# Altium schematic sheet USB Input.SchDoc
size A4; SheetNumber: 4; SheetTotal: 13
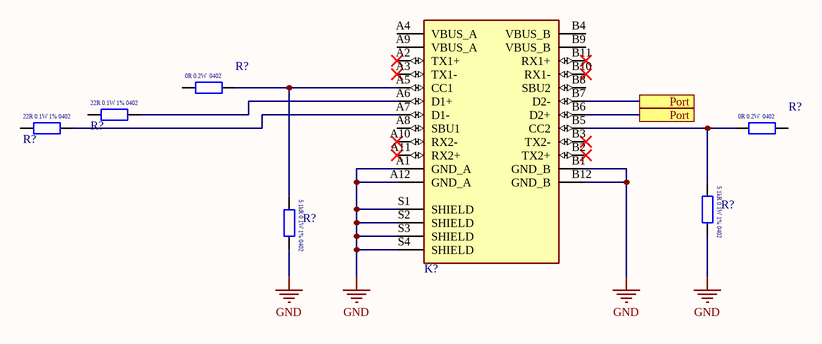
[diagram p0: USB Input.SchDoc]

## Parts
(Parts that share a designator on the sheet are numbered #1, #2 ... from top to bottom, then left to right.)
K?  2171830001  [217183-0001]  (value not drawn)
R?#1  CRCW04020000Z0EDHP  [RESC1005X04L]  (value not drawn)
R?#2  RK73H1ETTP22R0F  [RESC1005X04N]  (value not drawn)
R?#3  RK73H1ETTP22R0F  [RESC1005X04N]  (value not drawn)
R?#4  CRCW04020000Z0EDHP  [RESC1005X04L]  (value not drawn)
R?#5  RK73H1ETTP5101F  [RESC1005X04N]  (value not drawn)
R?#6  RK73H1ETTP5101F  [RESC1005X04N]  (value not drawn)

## Ports
Port

## Nets
GND: K?.A1(GND_A) K?.A12(GND_A) K?.B1(GND_B) K?.B12(GND_B) K?.S1(SHIELD) K?.S2(SHIELD) K?.S3(SHIELD) K?.S4(SHIELD) R?#5.2 R?#6.2
Port: K?.B6(D2+) K?.B7(D2-) ; port Port
NetK?_A5: K?.A5(CC1) R?#1.2 R?#6.1
NetK?_A6: K?.A6(D1+) R?#2.2
NetK?_A7: K?.A7(D1-) R?#3.2
NetK?_B5: K?.B5(CC2) R?#4.1 R?#5.1

Not connected (* = marked no-connect by the designer): K? A2(TX1+)* A3(TX1-)* A4(VBUS_A) A8(SBU1) A9(VBUS_A) A10(RX2-)* A11(RX2+)* B2(TX2+)* B3(TX2-)* B4(VBUS_B) B8(SBU2) B9(VBUS_B) B10(RX1-)* B11(RX1+)*; R?#1 1; R?#2 1; R?#3 1; R?#4 2

## Notes on the sheet
- (in symbol CRCW04020000Z0EDHP) 0R 0.2W  0402
- (in symbol RK73H1ETTP22R0F) 22R 0.1W 1% 0402
- (in symbol RK73H1ETTP5101F) 5.1kR 0.1W 1% 0402

## Library data of the parts
K? = 2171830001: USB-C (USB TYPE-C) USB 3.2 Gen 1 (USB 3.1 Gen 1, Superspeed (USB 3.0)) Receptacle Connector 24 Position Through Hole, Right Angle
R?#1 R?#4 = CRCW04020000Z0EDHP: 0 Ohms Jumper Chip Resistor 0402 (1005 Metric) Automotive AEC-Q200, Pulse Withstanding Thick Film; ComponentLink1Description: New link; ComponentLink1URL: https://www.digikey.com.au/en/products/detail/vishay-dale/CRCW04020000Z0EDHP/2222496; Supplier 1: Mouser; Supplier Part Number 1: 71-CRCW04020000Z0EDH
R?#2 R?#3 = RK73H1ETTP22R0F: 22 Ohms ±1% 0.1W, 1/10W Chip Resistor 0402 (1005 Metric) Automotive AEC-Q200 Thick Film
R?#5 R?#6 = RK73H1ETTP5101F: 5.1 kOhms ±1% 0.1W, 1/10W Chip Resistor 0402 (1005 Metric) Automotive AEC-Q200 Thick Film